# EAGLE design µ-USBasp_v1.2 (EAGLE 6.3)
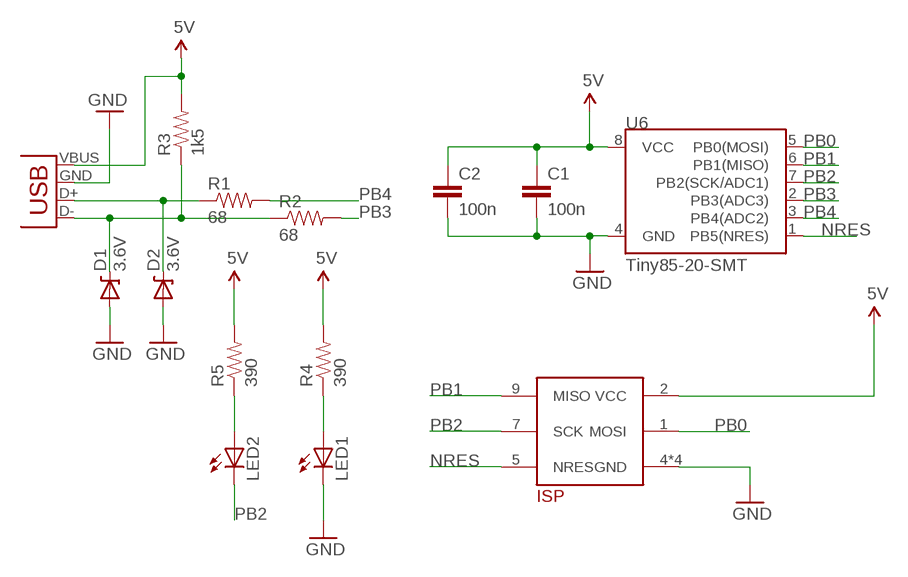
[diagram p0: schematic, sheet 1]

## Parts
C1  100n  CAP0805  [0805]
C2  100n  CAP0805  [0805]
D1  3.6V  DIODE-ZENER-BZT52  [SOD-323]
D2  3.6V  DIODE-ZENER-BZT52  [SOD-323]
JP2  USB-A-H  [USB-A-H]
LED1  LEDCHIPLED_0805  [CHIPLED_0805]
LED2  LEDCHIPLED_0805  [CHIPLED_0805]
R1  68  RESISTOR0805-RES  [0805]
R2  68  RESISTOR0805-RES  [0805]
R3  1k5  RESISTOR0805-RES  [0805]
R4  390  RESISTOR0805-RES  [0805]
R5  390  RESISTOR0805-RES  [0805]
U6  Tiny85-20-SMT  ATTINY45TINY85-20-SMT  [SO08-EIAJ]
U$1  TB_ISPEDGE_2X5_LONG  [ISP_EDGE2X5_LONG]

## Nets
5V [Power]: C1.1 C2.1 JP2.VBUS(GND) R3.2 R4.2 R5.2 U6.8(VCC) U$1.2(VCC)
GND [Power]: C1.2 C2.2 D1.2(A) D2.2(A) JP2.GND(VBUS) LED1.C U6.4(GND) U$1.4(GND) U$1.6(GND) U$1.8(GND) U$1.10(GND)
N$1: D1.1(C) JP2.D-(D+) R2.1 R3.1
N$2: D2.1(C) JP2.D+(D-) R1.1
N$3: LED1.A R4.1
N$5: LED2.A R5.1
NRES: U6.1(PB5(NRES)) U$1.5(NRES)
PB0: U6.5(PB0(MOSI)) U$1.1(MOSI)
PB1: U6.6(PB1(MISO)) U$1.9(MISO)
PB2: LED2.C U6.7(PB2(SCK/ADC1)) U$1.7(SCK)
PB3: R2.2 U6.2(PB3(ADC3))
PB4: R1.2 U6.3(PB4(ADC2))

## Library data of the parts
C1 C2 = SparkFun-Capacitors:CAP: Capacitor Standard 0603 ceramic capacitor, and 0.1" leaded capacitor.
D1 D2 = SparkFun-DiscreteSemi:DIODE-ZENER: Zener Diode Production Part - 8199 3.4V Zener Voltage
JP2 = SparkFun-Connectors:USB: USB Connectors USB-B-PTH is fully proven SKU : PRT-00139/CONN-08278 USB-miniB is fully proven SKU : PRT-00587 USB-A-PCB is untested. USB-A-H is throughly reviewed, but untested. Spark Fun Electronics SKU : PRT-00437 USB-B-SMT is throughly reviewed, but untested. Needs silkscreen touching up. USB-A-S has not been used/tested USB-MB-H has not been used/tested USB-MICROB has been used. CONN-09505
LED1 LED2 = led:LED: LED OSRAM: - CHIPLED LG R971, LG N971, LY N971, LG Q971, LY Q971, LO R971, LY R971 LH N974, LH R974 LS Q976, LO Q976, LY Q976 LO Q996 - Hyper CHIPLED LW Q18S LB Q993, LB Q99A, LB R99A - SideLED LS A670, LO A670, LY A670, LG A670, LP A670 LB A673, LV A673, LT A673, LW A673 LH A674 LY A675 LS A676, LA A676, LO A676, LY A676, LW A676 LS A679, LY A679, LG A679 - Hyper Micro SIDELED® LS Y876, LA Y876, LO Y876, LY Y876 LT Y87S - SmartLED LW L88C, LW L88S LB L89C, LB L89S, LG L890 LS L89K, LO L89K, LY L89K LS L896, LA L896, LO L896, LY L896 - TOPLED LS T670, LO T670, LY T670, LG T670, LP T670 LSG T670, LSP T670, LSY T670, LOP T670, LYG T670 LG T671, LOG T671, LSG T671 LB T673, LV T673, LT T673, LW T673 LH T674 LS T676, LA T676, LO T676, LY T676, LB T676, LH T676, LSB T676, LW T676 LB T67C, LV T67C, LT T67C, LS T67K, LO T67K, LY T67K, LW E67C LS E67B, LA E67B, LO E67B, LY E67B, LB E67C, LV E67C, LT E67C LW T67C LS T679, LY T679, LG T679 LS T770, LO T770, LY T770, LG T770, LP T770 LB T773, LV T773, LT T773, LW T773 LH T774 LS E675, LA E675, LY E675, LS T675 LS T776, LA T776, LO T776, LY T776, LB T776 LHGB T686 LT T68C, LB T68C - Hyper Mini TOPLED® LB M676 - Mini TOPLED Santana® LG M470 LS M47K, LO M47K, LY M47K Source: http://www.osram.convergy.de LUXEON: - LUMILED® LXK2-PW12-R00, LXK2-PW12-S00, LXK2-PW14-U00, LXK2-PW14-V00 LXK2-PM12-R00, LXK2-PM12-S00, LXK2-PM14-U00 LXK2-PE12-Q00, LXK2-PE12-R00, LXK2-PE12-S00, LXK2-PE14-T00, LXK2-PE14-U00 LXK2-PB12-K00, LXK2-PB12-L00, LXK2-PB12-M00, LXK2-PB14-N00, LXK2-PB14-P00, LXK2-PB14-Q00 LXK2-PR12-L00, LXK2-PR12-M00, LXK2-PR14-Q00, LXK2-PR14-R00 LXK2-PD12-Q00, LXK2-PD12-R00, LXK2-PD12-S00 LXK2-PH12-R00, LXK2-PH12-S00 LXK2-PL12-P00, LXK2-PL12-Q00, LXK2-PL12-R00 Source: www.luxeon.com KINGBRIGHT: KA-3528ASYC Source: www.kingbright.com
R1-R5 = SparkFun-Passives:RESISTOR: Resistor Basic schematic elements and footprints for 0603, 1206, and PTH resistors.
U6 = SparkFun-DigitalIC:ATTINY45: Atmel 8-pin 2/4/8kB flash uC; PROD_ID: IC-09092
U$1 = tb_custom:TB_ISPEDGE_2X5_LONG: AVR ISP connector at PCB edge - long pads for soldering

## Net classes
0 default: width 0.203 mm
1 Power: width 0.305 mm, clearance 0.305 mm

## Board
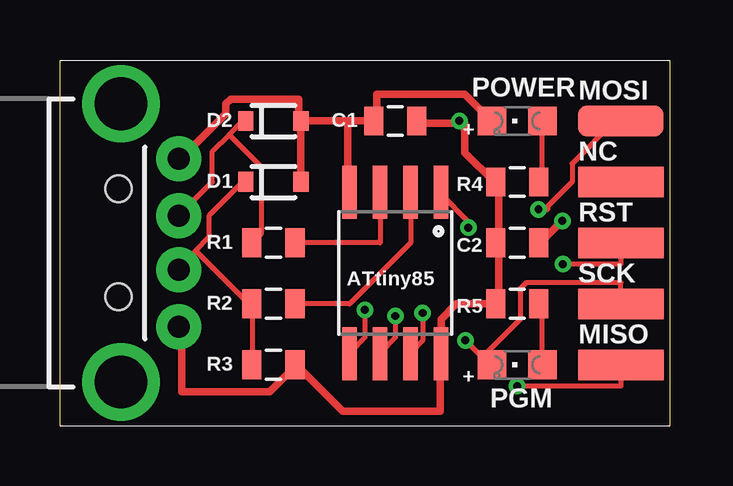
[diagram p1: board, top side]
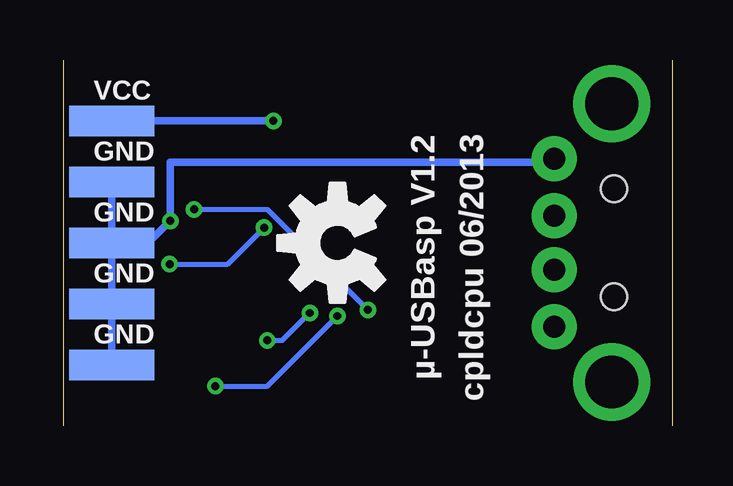
[diagram p2: board, bottom side, seen from below]

Size 25.4 x 15.24 mm. Coordinates in mm from the lower left corner, seen from the top.
Outline: 0,0 0,15.24
Outline: 25.4,15.24 25.4,0
Copper layers (1*16): Top 0.0356mm / dielectric 1.5011mm / Bottom 0.0356mm
Design rules "LaenPCBOrder": minimum track width 6mil, minimum drill 13mil, track to track 6mil, track to pad 6mil, pad to pad 6mil, via to via 6mil, smd to smd 6mil, copper to edge 15mil, drill to drill 6mil, minimum pad ring 7mil, minimum via ring 7mil, stop-mask expansion 4mil, vias tented up to drill 0mil, thermal gap 10mil

### Footprints (pad centres in the part's own frame; a part is rotated, then mirrored left to right if it is on the bottom)
0805 = smd 0.8 x 1.2: 1 -0.9,0; 2 0.9,0
SOD-323 = smd 0.63 x 0.83: 1 -1.15,0; 2 1.15,0
USB-A-H = drill 0.914 pad 1.88: D+ 2.4,1.127; D- 2.4,-1.127; GND 2.4,3.5; VBUS 2.4,-3.5 | drill 2.2: GND2 0,-5.8; GND3 0,5.8 | hole 1.1: -0.1,2.25; -0.1,-2.25
CHIPLED_0805 = smd 1.2 x 1.2: A 0,-1.05; C 0,1.05
SO08-EIAJ = smd 0.61 x 2.21: 1 -1.905,-3.378; 2 -0.635,-3.378; 3 0.635,-3.378; 4 1.905,-3.378; 5 1.905,3.353; 6 0.635,3.353; 7 -0.635,3.353; 8 -1.905,3.353
ISP_EDGE2X5_LONG = smd 3.556 x 1.27: 1 -0.762,5.08; 3 -0.762,2.54; 5 -0.762,0; 7 -0.762,-2.54; 9 -0.762,-5.08 | smd 3.556 x 1.27 bottom: 2 -0.762,5.08; 4 -0.762,2.54; 6 -0.762,0; 8 -0.762,-2.54; 10 -0.762,-5.08

### Placement (x,y rotation side)
C1  13.97,12.7 180 top
C2  19.05,7.62 0 top
D1  8.89,10.16 0 top
D2  8.89,12.7 0 top
JP2  2.54,7.62 0 top
LED1  19.05,12.7 90 top
LED2  19.05,2.54 90 top
R1  8.89,7.62 0 top
R2  8.89,5.08 0 top
R3  8.89,2.54 0 top
R4  19.05,10.16 180 top
R5  19.05,5.08 180 top
U6  13.97,6.35 180 top
U$1  24.13,7.62 0 top
U$2  [OSHW-LOGO-M]  13.97,7.62 90 bottom

### Tracks (layer width: path | path; a pad name or v marks a point on that pad's centre or on a via)
5V  (via drill 0.33)
  Top 0.305: JP2.VBUS 5.08,4.06 5.08,1.42 8.74,1.42 9.75,2.44 R3.2 9.96,2.44 11.79,0.61 15.85,0.61 15.85,2.85 U6.8 15.88,4.45 16.51,5.08 R5.2 18.29,5.08 18.29,7.52 C2.1 18.29,7.72 18.29,10.16 R4.2 18.09,10.16 16.87,11.38 16.87,12.6 16.64,12.6 | 16.64,12.6 15.04,12.6 C1.1 | v16.64,12.7 16.64,12.6
  Bottom 0.305: v16.64,12.7 U$1.2
GND  (via drill 0.33)
  Top 0.305: v20.93,8.53 20.12,7.72 20.07,7.62 C2.2 | U6.4 11.99,9.75 11.99,12.7 | 9.96,12.6 D2.2 | 9.96,10.16 D1.2 D2.2 | 13.01,12.8 C1.2 | 10.16,12.8 D2.2 | LED1.C 17.88,12.8 16.87,13.82 13.21,13.82 13.21,12.8 C1.2 | JP2.GND 5.08,11.18 6.91,13.01 6.91,13.41 7.11,13.61 9.96,13.61 9.96,12.8 D2.2 | 11.99,12.7 C1.2 | 11.99,12.7 D2.2
  Bottom 0.305: U$1.10 U$1.8 U$1.6 23.37,7.72 | 23.37,7.72 21.74,7.72 v20.93,8.53 20.93,10.97 5.08,10.97 JP2.GND | 23.37,7.72 U$1.4
N$1
  Top 0.203: R3.1 R2.1 7.87,5.08 5.65,7.3 | 5.65,7.3 4.95,6.6 JP2.D- | 5.65,7.3 6.22,7.87 6.22,8.76 7.62,10.16 D1.1
N$2
  Top 0.203: 7.05,12.13 6.35,11.43 6.35,10.16 4.95,8.76 JP2.D+ | 7.05,12.13 7.62,12.7 D2.1 | 8.38,8 R1.1 8.38,8 | 7.05,12.13 8.38,10.79 8.38,8
N$3
  Top 0.203: R4.1 20.07,10.16 20.07,12.57 LED1.A
N$5
  Top 0.203: LED2.A 20.07,2.54 20.07,5.08 R5.1
NRES  (via drill 0.33)
  Top 0.203: v17.02,8.26 17.02,8.51 15.88,9.65 U6.1 | v20.95,6.73 23.37,6.73 U$1.5
  Bottom 0.203: v17.02,8.26 18.54,6.73 v20.95,6.73
PB0  (via drill 0.33)
  Top 0.203: v12.7,4.83 12.7,3.68 12.06,3.05 U6.5 | v19.94,9.02 20.32,9.02 20.32,9.14 21.34,10.16 21.34,10.92 23.11,12.7 U$1.1
  Bottom 0.203: v12.7,4.83 16.89,9.02 v19.94,9.02
PB1  (via drill 0.33)
  Top 0.203: v13.97,4.57 13.97,3.68 13.34,3.05 U6.6 | v19.05,1.65 23.37,1.65 U$1.9
  Bottom 0.203: v13.97,4.57 16.89,1.65 v19.05,1.65
PB2  (via drill 0.33)
  Top 0.203: v15.11,4.7 15.11,3.56 14.61,3.05 U6.7 | v16.89,3.56 17.91,2.54 LED2.C 17.65,2.92 19.18,4.45 19.18,5.71 19.43,5.97 23.37,5.97 U$1.7
  Bottom 0.203: v15.11,4.7 16.26,3.56 v16.89,3.56
PB3
  Top 0.203: R2.2 12.06,5.08 14.61,7.62 U6.2
PB4
  Top 0.203: R1.2 13.34,7.62 U6.3

### Text on the board
tPlace: POWER | MOSI | D2 | C1 | + | NC | D1 | R4 | RST | R1 | C2 | ATtiny85 | SCK | R2 | R5 | MISO | R3 | + | PGM
bPlace: VCC | GND | GND | GND | GND | µ-USBasp V1.2 | cpldcpu 06/2013